# Altium schematic sheet Master.SchDoc
size A4; SheetNumber: 1; SheetTotal: 1
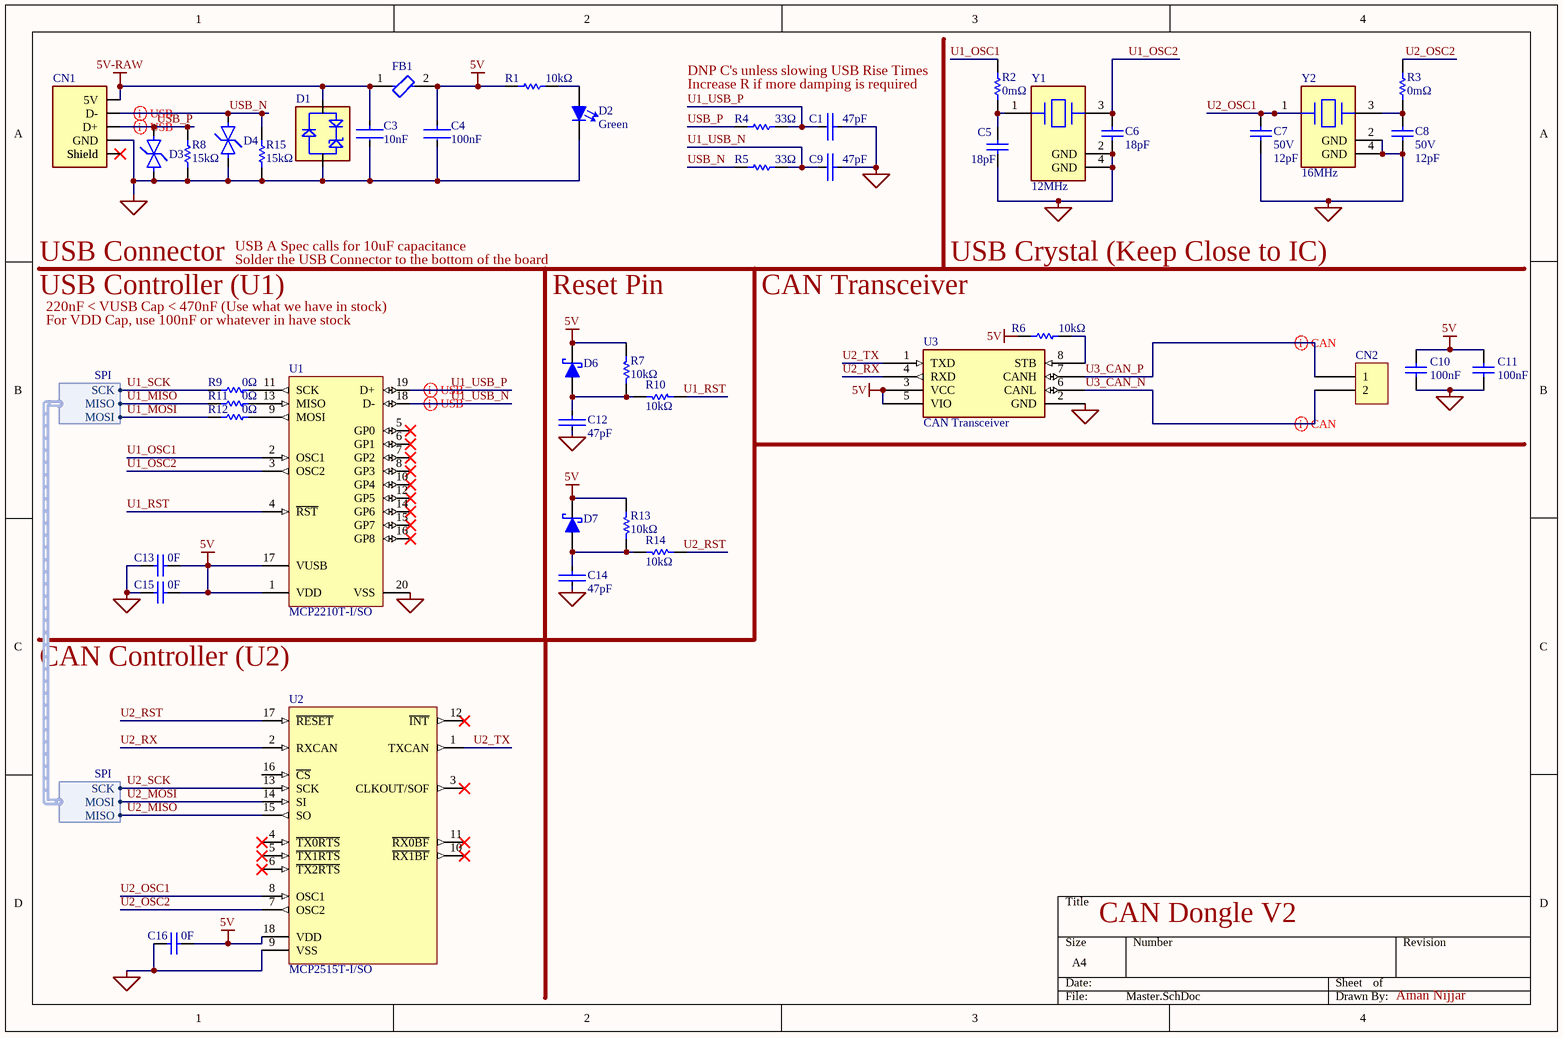
[diagram p0: Master.SchDoc]

## Parts
C1  value 47pF  [FP-0603-L_1_6_0_15-W_0_81-IPC_C]  (hidden comment: 06031A470JAT2A)
C3  Capacitance: 10nF  [FP-AC0603-IPC_C]  (hidden comment: AC0603KRX7R9BB103)
C4  Capacitance: 100nF  [FP-AC0603-IPC_C]  (hidden comment: AC0603KRX7R9BB103)
C5  18pF  [CAPC1608X92X38NL15T08]
C6  18pF  [CAPC1608X92X38NL15T08]
C7  Voltage: 50V  Capacitance: 12pF  [CAPC1005X55X25ML05T10]  (hidden comment: GRM1555C1H120GA01D)
C8  Voltage: 50V  Capacitance: 12pF  [CAPC1005X55X25ML05T10]  (hidden comment: GRM1555C1H120GA01D)
C9  value 47pF  [FP-0603-L_1_6_0_15-W_0_81-IPC_C]  (hidden comment: 06031A470JAT2A)
C10  Capacitance: 100nF  [FP-CL10-0_1-IPC_A]  (hidden comment: CL10B104JB8NNNC)
C11  Capacitance: 100nF  [FP-CL10-0_1-IPC_A]  (hidden comment: CL10B104JB8NNNC)
C12  value 47pF  [FP-0603-L_1_6_0_15-W_0_81-IPC_C]  (hidden comment: 06031A470JAT2A)
C13  value 0F  [CAPC1608N(0603")]  (hidden comment: Placeholder_Capacitor_0603)
C14  value 47pF  [FP-0603-L_1_6_0_15-W_0_81-IPC_C]  (hidden comment: 06031A470JAT2A)
C15  value 0F  [CAPC1608N(0603")]  (hidden comment: Placeholder_Capacitor_0603)
C16  value 0F  [CAPC1608N(0603")]  (hidden comment: Placeholder_Capacitor_0603)
CN1  USB-A, Plug, TH  [USB-A, Plug, TH-Footprint-1]  (value not drawn)
CN2  1x2 Shrouded Right Angle  [2X1 Female Header]  (value not drawn)
D1  D5V0F1U2S9-7  [D5V0F1U2S9-7-Footprint-1]  (value not drawn)
D2  Color: Green  [FP-LB_Q39E-MFG]  (hidden comment: LT Q39G-Q1OO-25-1)
D3  ESD321DPYR  [FP-DPY0002A-MFG]  (value not drawn)
D4  ESD321DPYR  [FP-DPY0002A-MFG]  (value not drawn)
D6  CUS08F30,H3F  [SC-76]  (value not drawn)
D7  CUS08F30,H3F  [SC-76]  (value not drawn)
FB1  BLM18PG330SN1D  [FP-BLM18-0_15-t0_8-d1_2-MFG]  (value not drawn)
R1  Resistance: 10kΩ  [RESC1608X55X25ML10T15]  (hidden comment: RC0603FR-0710KL)
R2  value 0mΩ  [RESC1608X55X25ML10T15]  (hidden comment: RC0603JR-070RL)
R3  value 0mΩ  [RESC1608X55X25ML10T15]  (hidden comment: RC0603JR-070RL)
R4  Resistance: 33Ω  [RESC1608X55X25ML10T15]  (hidden comment: RC0603FR-0733RL)
R5  Resistance: 33Ω  [RESC1608X55X25ML10T15]  (hidden comment: RC0603FR-0733RL)
R6  Resistance: 10kΩ  [RESC1608X55X25ML10T15]  (hidden comment: RC0603FR-0710KL)
R7  Resistance: 10kΩ  [RESC1608X55X25ML10T15]  (hidden comment: RC0603FR-0710KL)
R8  Resistance: 15kΩ  [RESC1608X55X25ML10T15]  (hidden comment: RC0603FR-0733RL)
R9  0Ω  [RESC1608X55X25ML10T15]
R10  Resistance: 10kΩ  [RESC1608X55X25ML10T15]  (hidden comment: RC0603FR-0710KL)
R11  0Ω  [RESC1608X55X25ML10T15]
R12  0Ω  [RESC1608X55X25ML10T15]
R13  Resistance: 10kΩ  [RESC1608X55X25ML10T15]  (hidden comment: RC0603FR-0710KL)
R14  Resistance: 10kΩ  [RESC1608X55X25ML10T15]  (hidden comment: RC0603FR-0710KL)
R15  Resistance: 15kΩ  [RESC1608X55X25ML10T15]  (hidden comment: RC0603FR-0733RL)
U1  MCP2210T-I/SO  [SOIC-SO20_M]
U2  MCP2515T-I/SO  [SOIC-SO18_N]
U3  CAN Transceiver  [8-SOIC]
Y1  12MHz  [FP-8Z-MFG]
Y2  16MHz  [FP-AM-MFG]

## Harnesses
SPI: SCK, MISO, MOSI

## Nets
5V: C4.1 C10.2 C11.2 C13.2(Cathode) C15.2(Cathode) C16.2(Cathode) D6.K(Cathode) D7.K(Cathode) FB1.2 R1.1 R6.1 R7.2 R13.2 U1.1(VDD) U1.17(VUSB) U2.18(VDD) U3.3(VCC) U3.5(VIO)
5V-RAW: C3.1 CN1.1(5V) D1.1 FB1.1
GND: C1.1 C3.2 C4.2 C5.1 C6.1 C7.1 C8.1 C9.1 C10.1 C11.1 C12.2 C13.1(Anode) C14.2 C15.1(Anode) C16.1(Anode) CN1.4(GND) D1.2 D2.1(Cathode) D3.2(GND) D4.2(GND) R8.1 R15.1 U1.20(VSS) U2.9(VSS) U3.2(GND) Y1.2(GND) Y1.4(GND) Y2.2(GND) Y2.4(GND)
U1_MISO: R11.1 U2.15(SO) ; harness SPI.MISO  [also labelled U2_MISO]
U1_MOSI: R12.1 U2.14(SI) ; harness SPI.MOSI  [also labelled U2_MOSI]
U1_OSC1: R2.2 U1.2(OSC1)
U1_OSC2: C6.2 U1.3(OSC2) Y1.3
U1_RST: R10.2 U1.4(~{RST})
U1_SCK: R9.1 U2.13(SCK) ; harness SPI.SCK  [also labelled U2_SCK]
U1_USB_N: C9.2 R5.2 U1.18(D-)
U1_USB_P: C1.2 R4.2 U1.19(D+)
U2_OSC1: C7.2 U2.8(OSC1) Y2.1
U2_OSC2: R3.2 U2.7(OSC2)
U2_RST: R14.2 U2.17(~{RESET})
U2_RX: U2.2(RXCAN) U3.4(RXD)
U2_TX: U2.1(TXCAN) U3.1(TXD)
U3_CAN_N: CN2.2 U3.6(CANL)
U3_CAN_P: CN2.1 U3.7(CANH)
USB_N: CN1.2(D-) D4.1(IO) R5.1 R15.2
USB_P: CN1.3(D+) D3.1(IO) R4.1 R8.2
NetC5_2: C5.2 R2.1 Y1.1
NetC8_2: C8.2 R3.1 Y2.3
NetC12_1: C12.1 D6.A(Anode) R7.1 R10.1
NetC14_1: C14.1 D7.A(Anode) R13.1 R14.1
NetCN1_MH1: CN1.MH1(Shield) CN1.MH2(Shield)
NetD2_2: D2.2(Anode) R1.2
NetR6_2: R6.2 U3.8(STB)
NetR9_2: R9.2 U1.11(SCK)
NetR11_2: R11.2 U1.13(MISO)
NetR12_2: R12.2 U1.9(MOSI)

Not connected (* = marked no-connect by the designer): U1 5(GP0)* 6(GP1)* 7(GP2)* 8(GP3)* 10(GP4)* 12(GP5)* 14(GP6)* 15(GP7)* 16(GP8)*; U2 3(CLKOUT/SOF)* 4(~{TX0RTS})* 5(~{TX1RTS})* 6(~{TX2RTS})* 10(~{RX1BF})* 11(~{RX0BF})* 12(~{INT})* 16(~{CS})

## Layout directives
differential pair: U1_USB_N, U1_USB_P, U3_CAN_N, U3_CAN_P, USB_N, USB_P

## Notes on the sheet
- DNP C's unless slowing USB Rise Times
- Increase R if more damping is required
- USB A Spec calls for 10uF capacitance
- USB Controller (U1)
- USB Connector
- 220nF < VUSB Cap < 470nF (Use what we have in stock)
- Solder the USB Connector to the bottom of the board
- Reset Pin
- CAN Transceiver
- USB Crystal (Keep Close to IC)
- For VDD Cap, use 100nF or whatever in have stock
- CAN Controller (U2)
- CAN Dongle V2
- Aman Nijjar

## Library data of the parts
C1 C9 C12 C14 = CMP-00198-1: 47pF ± 5%, 100V, 0603 C0G/NP0; Temperature Coefficient: 30ppm/°C; Dielectric: C0G; Dielectric Material: Ceramic; Series: -; Mounting Technology: Surface Mount; RoHS Compliant: Yes; Voltage: 100V; Height: 0.86mm; Package Quantity: 1; Reach SVHC Compliant: No; Depth: 0.81mm; Termination: SMD/SMT; Max Operating Temperature: 125°C; Width: 0.032inch; Min Operating Temperature: -55°C; Voltage Rating: 100V; Length: 1.6mm; Case Code (Imperial): 0603; Radiation Hardening: No; Case Code (Metric): 1608; Packaging: Tape and Reel; Lead Free: Lead Free; Pins: 2; Thickness: 0.035inch; Construction: Flat; Tolerance: 5%; Case/Package: 0603
C3 C4 = CMP-00152-2: AC Series 0603 10 nF 50 V 10% X7R Multilayer Ceramic Capacitor; Voltage Rating: 50V; Lead Free: Lead Free; Min Operating Temperature: -55°C; Max Operating Temperature: 125°C; RoHS Compliant: Yes; Mount: Surface Mount; Case Code (Metric): 1608; Ratings: AEC-Q200; Tolerance: 10%; Case Code (Imperial): 0603; Case/Package: 0603; Packaging: Cut Tape
C5 C6 = CMP-2006-01495-1: Manufacturer: Vitramon; Part Number: VJ0603D180JXPAJ
C7 C8 = CMP-00106-1: MURATA - GRM1555C1H120GA01D - SMD flerskiktig keramisk kondensator, 12 pF, 50 V, 0402 [1005 Metrisk], ± 2%, C0G / NP0, GRM Series; Material: Ceramic; Min Operating Temperature: -55°C; Case Code (Imperial): 0402; Termination: SMD/SMT; Mount: Surface Mount; Tolerance: 2%; Packaging: Tape and Reel; Thickness: 0.022inch; Package Quantity: 10000; REACH SVHC: No SVHC; Lead Free: Lead Free; Case/Package: 0402; Voltage Rating (DC): 50V; Max Operating Temperature: 125°C; Height: 0.5mm; Case Code (Metric): 1005; Radiation Hardening: No; Depth: 0.5mm; Dielectric: C0G; Length: 1mm; Voltage Rating: 50V; Width: 0.5mm
C10 C11 = CMP-00000-4: CAP CER 0.1UF 50V X7R 0603; Tolerance: 5%; Material: Ceramic; Packaging: Tape and Reel; Max Operating Temperature: 125°C; Mount: Surface Mount; Voltage Rating: 50V; Package Quantity: 1; Radiation Hardening: No; Depth: 0.8mm; Case Code (Metric): 1608; Case Code (Imperial): 0603; Case/Package: 0603; Width: 0.031inch; Contact Plating: Tin; Length: 1.6mm; Dielectric: X7R; Min Operating Temperature: -55°C; Voltage: 50V; Height: 0.8mm; Thickness: 0.035inch
C13 C15 C16 = CMP-006-0054-1: Placeholder 0603 SMT Footprint; Made By: Ashwin Sira; Date Created: 2016-06-26; Design Item ID: Placeholder_Capacitor_0603; PackageDescription: Chip Capacitor; Component Type: Standard (No BOM); Pin Count: 2; Source: AUVic_Schematic_Library_Capacitors.SchLib; Publisher: AUVic
CN1 = CMP-00208-4: Connector Type: USB; Voltage Rating (AC): 150V; Number of Ports: 1; Number of Positions: 4; Current Rating: 1.5A; Insulation Resistance: 1GR; Gender: Male; Packaging: Tray; Mounting Technology: Through Hole; Contact Plating: Gold; Halogen Free: Low Halogen; Contact Material: Brass; Reach SVHC Compliant: Unknown; Color: Black; Min Operating Temperature: -20°C; Voltage Rating: 150V; Flammability Rating: UL94 V-0; Package Quantity: 1000; Depth: 18.8mm; Lead Free: Lead Free; Termination: Through Hole; Series: 48037; Length: 12.7mm; Max Operating Temperature: 85°C; Max Voltage Rating (AC): 150V; Number of Contacts: 4; Orientation: Right Angle; Number of Circuits: 4; Housing Material: Thermoplastic; Housing Color: Black; Weight: 0.08113oz
CN2 = CMP-00010-3: 02 MTE HDR SRRA LATCH; Connector Type: Plug,Header,Pin; Backwall/Post Interruptions: No (Without); Pitch: 2.54mm; Approvals: CSA; Gender: Male; Contact Resistance: 15mR; PCB Thickness: 0.062inch; Contact Current Rating: 3A; Contact Retention: Yes (With); Number of Contacts: 2; PCB Mount Retention: Without; Insulation Resistance: 5GR; Row Spacing: 0.1inch; Tail Length: 3.3mm; Contact Plating: Gold,Tin,Matte; ELV: Compliant; Height: 13.59mm; Package Quantity: 68; Current Rating: 3A; Mount: Through Hole; Number of Rows: 1; Contact Material: Brass; Max Operating Temperature: 105°C; Lead Free: Lead Free; Mating Alignment: Yes (With); Min Operating Temperature: -65°C; Flammability Rating: UL94 V-0; Mating Retention: Yes (With); Color: Black; Number of Positions: 2; REACH SVHC: Unknown; Contact Mating Length: 0.23inch; Orientation: Right Angle; Packaging: Rail/Tube; Termination: Crimp; PCB Mount Alignment: No (Without); Contact Shape: Square; PCB Mounting Orientation: Right Angle; Housing Color: Black; Depth: 13.59mm; Length: 7.62mm; Contact Gender: Male; Strain Relief: No (Without); Housing Material: Thermoplastic
D1 = CMP-00206-1: Diode TVS Dual Uni-Dir 5.5V 250000W 2-Pin SOD-923 T/R; Peak Pulse Current: 1.5A; Max Reverse Leakage Current: 100nA; Diode Type: ZENER; Max Power Dissipation: 250mW; Clamping Voltage: 10V; Value: 5E-13F; ESD Protection: Yes; Polarity: Unidirectional; Peak Pulse Power: 250kW; Number of Unidirectional Channels: 1; Breakdown Voltage: 6V; Max Operating Temperature: 150°C; Package Quantity: 10000; Reverse Standoff Voltage: 5.5V; Series: -; Max Surge Current: 1.5A; RoHS Compliant: Yes; Case/Package: SOD-923-2; Min Operating Temperature: -65°C; Mounting Technology: Surface Mount; Direction: Unidirectional; Packaging: Tape and Reel; Power Line Protection: Yes; Min Breakdown Voltage: 6V; Working Voltage: 5.5V; Termination: SMD/SMT; Contact Plating: Tin,Matte
D2 = CMP-00064-3: LED GREEN DIFFUSED 0603 SMD; Dominant Wavelength: 530nm; Luminous Intensity: 280mcd; Lens Style: Diffused,Colorless,Rectangular; Number of LEDs: 1; Forward Voltage: 2.85V; Test Current: 5mA; Reverse Voltage: 5V; Forward Current: 15mA; Luminous Flux: 0.55lm; Radiation Hardening: No; Packaging: Tape and Reel; Mount: Surface Mount; Max Operating Temperature: 85°C; Number of Elements: 1; Number of Pins: 2; Min Operating Temperature: -40°C; Depth: 0.9mm; Case/Package: SMD/SMT; Length: 1.7mm
D3 D4 = CMP-00211-1: ESD Suppressor Diode TVS Uni-Dir 3.6V 2-Pin X1SON T/R; RoHS Compliant: Yes
D6 D7 = CMP-057-0000-2: Diode Schottky 30V 800mA Surface Mount USC; Peak Non-Repetitive Surge Current: 5A; Element Configuration: Single; Peak Reverse Current: 50uA; Packaging: Tape and Reel; Mount: Surface Mount; Average Rectified Current: 800mA; Case/Package: SOD; Max Reverse Voltage (DC): 30V; Min Operating Temperature: -55°C; Contact Plating: Tin,Silver; Max Repetitive Reverse Voltage (Vrrm): 30V; Number of Pins: 2; Max Operating Temperature: 125°C
FB1 = CMP-0686-00590-4: Chip Ferrite Bead, 0603, 33Ω @ 100MHz, 0.025Ω, 25%, 3A; Manufacturer Series: BLM18P; Shielding: Unshielded; Number of Functions: 1; Resistance: 25mR; ESR (Equivalent Series Resistance): 33R; Material: Steel; Packaging: Tape and Reel; Test Frequency: 100MHz; Length: 1.6mm; DC Current: 3A; Height: 0.8mm; Current Rating: 3A; Case/Package: 0603; Number of Lines: 1; Lead Free: Lead Free; RoHS Compliant: Yes; Max Current Rating: 3A; Case Code (Metric): 1608; Core Material: Ferrite; REACH SVHC: No SVHC; Min Operating Temperature: -55°C; Number of Pins: 2; DC Resistance (DCR): 25mR; Number of Circuits: 1; Series: BLM18P; Radiation Hardening: No; Max DC Current: 3A; Depth: 0.8mm; Terminal Finish: Tin; Package Quantity: 1; Case Code (Imperial): 0603; Impedance: 33R; Tolerance: 25%; Width: 0.8mm; Termination: SMD/SMT; DC Resistance-Max: 25mR; Max Operating Temperature: 125°C
R1 R6 R7 R10 R13 R14 = CMP-00037-3: 10kΩ ± 1%, 1/10W, ±100ppm 0603; Voltage Rating: 75V; Voltage Rating (DC): 50V; Temperature Coefficient: 100ppm/°C; Power Rating: 100mW; Military Standard: Not; Case Code (Imperial): 0603; Weight: 7.1E-05oz; Depth: 0.8mm; Max Operating Temperature: 155°C; Tolerance: 1%; Termination: SMD/SMT; Composition: Thick Film; Lead Free: Lead Free; Height: 0.45mm; Case/Package: 0603; Min Operating Temperature: -55°C; Lead Pitch: 0.3mm; Width: 0.8mm; Length: 1.6mm; REACH SVHC: No SVHC; Case Code (Metric): 1608; Packaging: Tape and Reel; Number of Pins: 2
R2 R3 = CMP-00214-1: RES SMD 0 OHM JUMPER 1/10W 0603; Temperature Coefficient: 200ppm/°C; Power Rating: 100mW; Tolerance: 1%; Resistance Tolerance: 5%; Voltage Rating: 50V; Case/Package: 0603; Packaging: Tape and Reel; Max Power Dissipation: 100mW; Reach SVHC Compliant: Unknown; Case Code (Metric): 1608; Min Operating Temperature: -55°C; Series: RC; Technology: THICK FILM; Termination: SMD/SMT; Military Standard: Not; Construction: Rectangular; Width: 0.8mm; Contact Plating: Tin,Matte; Features: Moisture Resistant; Number of Terminations: 2; Lead Free: Lead Free; Depth: 0.8mm; RoHS Compliant: Yes; Pins: 2; Resistor Type: Thick Film; Package Quantity: 5000; Height: 0.45mm; Max Operating Temperature: 155°C; Length: 1.6mm; Case Code (Imperial): 0603; Voltage Rating (DC): 50V
R4 R5 R8 R15 = CMP-00060-2: Res Thick Film 0603 33 Ohm 1% 1/10W +/-100ppm/ßC Molded SMD Paper T/R; Max Power Dissipation: 100mW; Voltage Rating (DC): 50V; Voltage Rating: 75V; Temperature Coefficient: 100ppm/°C; Package Quantity: 1; Max Operating Temperature: 155°C; Lead Free: Lead Free; Length: 1.6mm; REACH SVHC: No SVHC; Tolerance: 1%; Case Code (Metric): 1608; Weight: 7.1E-05oz; Number of Pins: 2; Width: 0.8mm; Lead Pitch: 0.3mm; Military Standard: Not; Composition: Thick Film; Termination: SMD/SMT; Features: Moisture Resistant; Case/Package: 0603; Min Operating Temperature: -55°C; Number of Terminations: 2; Height: 0.45mm; Case Code (Imperial): 0603; Depth: 0.8mm; Packaging: Tape and Reel; Power Rating: 100mW
R9 R11 R12 = CMP-2100-03667-1: Chip Resistor, 0 Ohm, +/- 5%, 0.1 W, -55 to 155 degC, 0603 (1608 Metric), RoHS, Tape and Reel; Manufacturer: Yageo; Temperature Coefficient: 200ppm/degreesC; Voltage Rating: 50V; Power Rating: 100mW; Resistance: 0mOhm; Width: 0.8mm; Max Operating Temperature: 155degC; Tolerance: 5%; Package Reference: 0603; Height: 0.45mm; Depth: 0.8mm; Package Description: 2-Pin Surface Mount Device, Body 1.6 x 0.8 mm; Termination: SMD/SMT; Package Quantity: 5000; Case/Package: 0603; Case Code (Imperial): 0603; Radiation Hardening: No; Number of Pins: 2; Length: 1.6mm; Lead Free: LeadFree; Voltage Rating (DC): 50V; Military Standard: Not; Datasheet URL: http://www.yageo.com/NewPortal/yageodocoutput?fileName=/pdf/R-Chip/PYu-RC_Group_51_RoHS_L_5.pdf; Manufacturer URL: http://www.yageo.com/; Packaging: TapeandReel; Case Code (Metric): 1608; Min Operating Temperature: -55degC; Composition: ThickFilm; RoHSCompliant: true; Contact Plating: Tin; Datasheet Version: Rev. 5, 10/2016; REACH SVHC: NoSVHC
U1 = CMP-00209-1: USB to SPI Protocol Converter 20 SOIC .300in T/R RoHS Compliant: Yes; Operating Supply Voltage: 5.5V; Data Rate: 480Mbps; Operating Supply Current: 13mA; Case/Package: SOIC; Package Quantity: 1600; RoHS Compliant: Yes; Interface: SPI; Radiation Hardening: No; Max Operating Temperature: 85°C; Packaging: Tape and Reel; Min Operating Temperature: -40°C
U2 = CMP-0186-00139-2: Stand-Alone CAN Controller With SPI Interface, 18-Pin SOIC, Industrial Temperature, Tape and Reel; RevisionNote: URLs added. DatasheetVersion updated.; ComponentLink1Description: Manufacturer URL; Code_JEDEC: MS-013; ComponentLink2URL: http://ww1.microchip.com/downloads/en/DeviceDoc/21801f.pdf; ComponentLink3Description: Package Specification; PackageVersion: revBB, Aug-2009; PackageReference: SOIC-SO18; ComponentLink2Description: Datasheet; DatasheetVersion: revF, Oct-2010; PackageDescription: 18-Lead Plastic Small Outline (SO) - Wide 7.50mm Body [SOIC]; ComponentLink1URL: http://www.microchip.com/; ComponentLink3URL: http://www.microchip.com/stellent/groups/techpub_sg/documents/packagingspec/en012702.pdf
U3 = CMP-032-0000-3: 1/1 Transceiver Half CANbus 8-SO; Propagation Delay: 250ns; Data Rate: 1Mbps; Number of Transceivers: 1; Nominal Supply Current: 70mA; Min Supply Voltage: 4.5V; Max Supply Voltage: 5.5V; Max Operating Temperature: 150°C; Turn-On Delay Time: 250ns; Packaging: Tape and Reel; Case/Package: SO; Number of Pins: 8; Min Operating Temperature: -40°C; Radiation Hardening: No; Max Supply Current: 70mA; Mount: Surface Mount; Package Quantity: 2500; Interface: CAN; Contact Plating: Gold; Lead Free: Lead Free
Y1 = CMP-043-0009-1: Crystal 12MHz ±30ppm (Tol) ±30ppm (Stability) 18pF FUND 150Ohm 4-Pin SMD T/R; ESR (Equivalent Series Resistance): 150R; Packaging: Tape and Reel; Load Capacitance: 18pF; Frequency Tolerance: 30ppm; Case/Package: SMD/SMT; Termination: SMD/SMT; Height: 0.022inch; Depth: 2mm; Min Operating Temperature: -20°C; Frequency: 12MHz; REACH SVHC: No SVHC; Frequency Stability: 30ppm; Max Operating Temperature: 70°C; Package Quantity: 1; Mount: Surface Mount; Number of Pins: 4; Width: 0.079inch; Tolerance: 30ppm; Length: 2.5mm
Y2 = CMP-00105-1: Crystals 16.000MHz 30ppm 12pF -40C to 85C; ESR (Equivalent Series Resistance): 100R; Frequency Stability: 50ppm; Width: 2.5mm; Tolerance: 30ppm; Frequency Tolerance: 30ppm; Max Operating Temperature: 85°C; Length: 0.126inch; Termination: SMD/SMT; Package Quantity: 3000; Height: 0.028inch; Frequency: 16MHz; Ratings: AEC-Q200; Number of Pins: 4; Load Capacitance: 12pF; Min Operating Temperature: -40°C; REACH SVHC: No SVHC; Packaging: Tape and Reel; Mount: Surface Mount; Case/Package: SMD/SMT